# Altium schematic sheet PWR.SchDoc
size A4; SheetNumber: 6; SheetTotal: 14
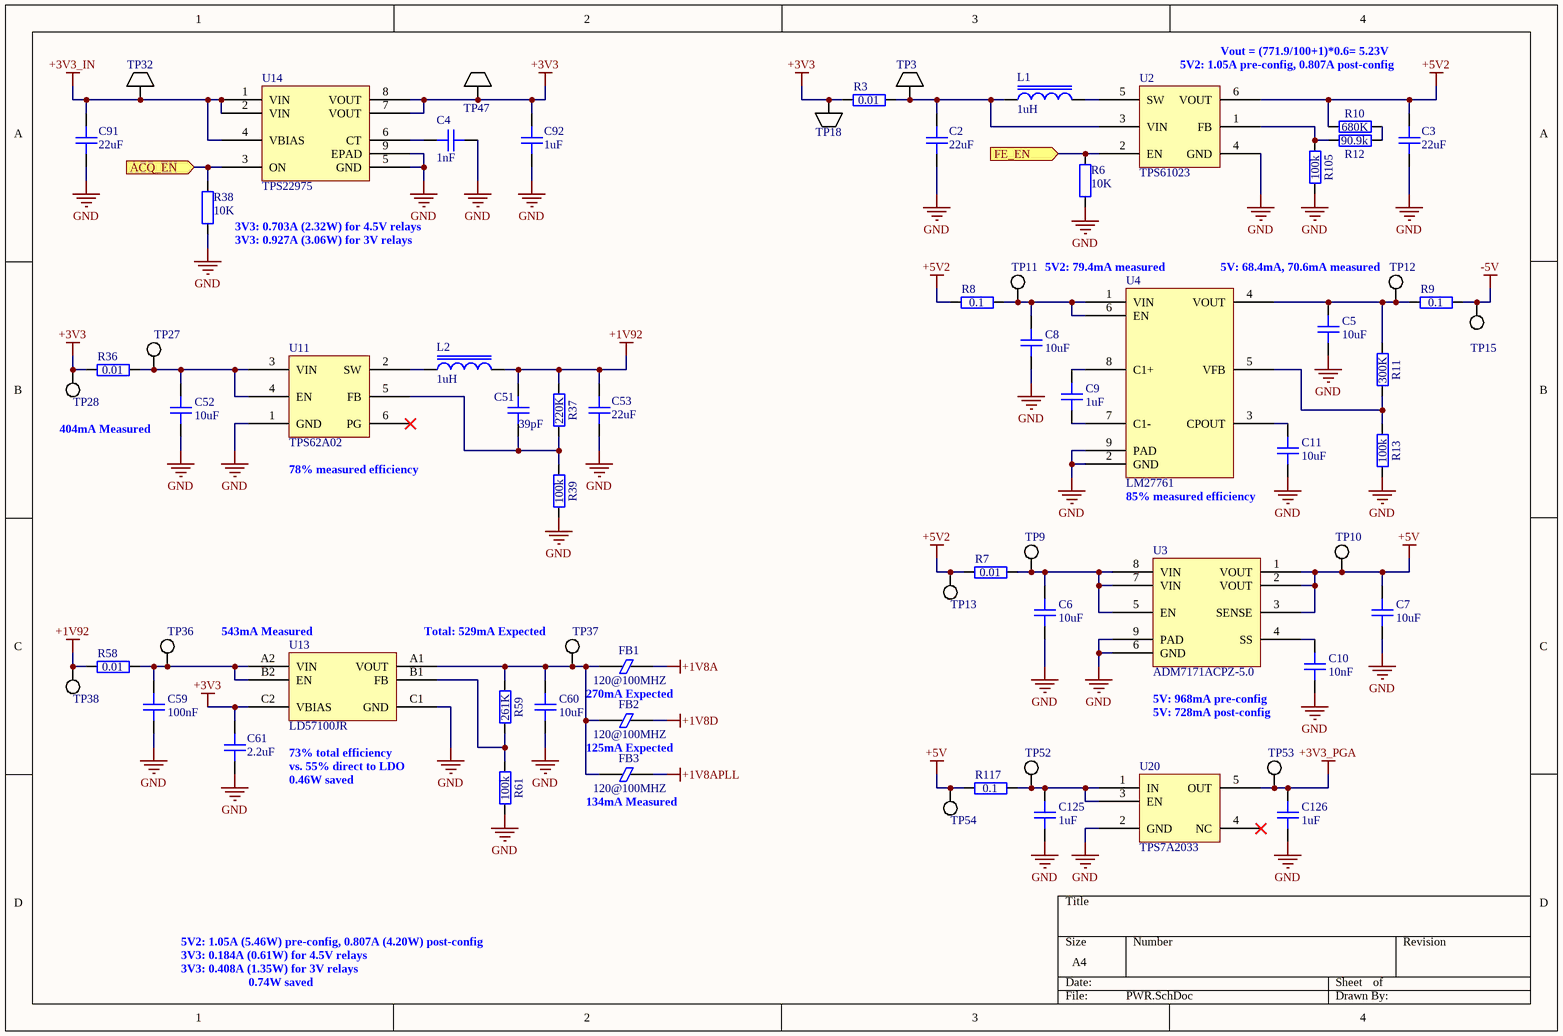
[diagram p0: PWR.SchDoc]

## Parts
C2  22uF  [GEN_C_0805]
C3  22uF  [GEN_C_0805]
C4  1nF  [GEN_C_0402]
C5  10uF  [GEN_C_0603]
C6  10uF  [GEN_C_0603]
C7  10uF  [GEN_C_0603]
C8  10uF  [GEN_C_0603]
C9  1uF  [GEN_C_0402]
C10  10nF  [GEN_C_0402]
C11  10uF  [GEN_C_0603]
C51  39pF  [GEN_C_0402]
C52  10uF  [GEN_C_0603]
C53  22uF  [GEN_C_0805]
C59  100nF  [GEN_C_0402]
C60  10uF  [GEN_C_0603]
C61  2.2uF  [GEN_C_0402]
C91  22uF  [GEN_C_0805]
C92  1uF  [GEN_C_0402]
C125  1uF  [GEN_C_0402]
C126  1uF  [GEN_C_0402]
FB1  120@100MHZ  [GEN_R_0402]
FB2  120@100MHZ  [GEN_R_0402]
FB3  120@100MHZ  [GEN_R_0402]
L1  1uH  [GEN_L_1210]
L2  1uH  [GEN_L_1210]
R3  0.01  [GEN_R_0603]
R6  10K  [GEN_R_0402]
R7  0.01  [GEN_R_0603]
R8  0.1  [GEN_R_0402]
R9  0.1  [GEN_R_0402]
R10  680K  [GEN_R_0402]
R11  300K  [GEN_R_0402]
R12  90.9k  [GEN_R_0402]
R13  100k  [GEN_R_0402]
R36  0.01  [GEN_R_0603]
R37  220K  [GEN_R_0402]
R38  10K  [GEN_R_0402]
R39  100k  [GEN_R_0402]
R58  0.01  [GEN_R_0603]
R59  261K  [GEN_R_0402]
R61  100k  [GEN_R_0402]
R105  100k  [GEN_R_0402]
R117  0.1  [GEN_R_0402]
TP3  5015  [KEY_5015]  (value not drawn)
TP9  PCB  [GEN_TP_PCB]  (value not drawn)  (no BOM)
TP10  PCB  [GEN_TP_PCB]  (value not drawn)  (no BOM)
TP11  PCB  [GEN_TP_PCB]  (value not drawn)  (no BOM)
TP12  PCB  [GEN_TP_PCB]  (value not drawn)  (no BOM)
TP13  PCB  [GEN_TP_PCB]  (value not drawn)  (no BOM)
TP15  PCB  [GEN_TP_PCB]  (value not drawn)  (no BOM)
TP18  5015  [KEY_5015]  (value not drawn)
TP27  PCB  [GEN_TP_PCB]  (value not drawn)  (no BOM)
TP28  PCB  [GEN_TP_PCB]  (value not drawn)  (no BOM)
TP32  5015  [KEY_5015]  (value not drawn)
TP36  PCB  [GEN_TP_PCB]  (value not drawn)  (no BOM)
TP37  PCB  [GEN_TP_PCB]  (value not drawn)  (no BOM)
TP38  PCB  [GEN_TP_PCB]  (value not drawn)  (no BOM)
TP47  5015  [KEY_5015]  (value not drawn)
TP52  PCB  [GEN_TP_PCB]  (value not drawn)  (no BOM)
TP53  PCB  [GEN_TP_PCB]  (value not drawn)  (no BOM)
TP54  PCB  [GEN_TP_PCB]  (value not drawn)  (no BOM)
U2  TPS61023  [TI_SOT563_DRL0006A]
U3  ADM7171ACPZ-5.0  [AD_DFN8_CP-8-21]
U4  LM27761  [TI_WSON8_DSG0008A]
U11  TPS62A02  [TI_SOT563_DRL0006A]
U13  LD57100JR  [ST_FlipChip6]
U14  TPS22975  [TI_WSON8_DSG0008A]
U20  TPS7A2033  [GEN_SOT23_5_950_2900X1600X1450]

## Ports
ACQ_EN (in), FE_EN (in)

## Nets
+1V8A: FB1.2
+1V8APLL: FB3.2
+1V8D: FB2.2
+1V92: C51.2 C53.2 L2.2 R37.2 R58.1 TP38.1
+3V3: C61.2 C92.2 R3.2 R36.1 TP18.1 TP28.1 TP47.1 U13.C2(VBIAS) U14.7(VOUT) U14.8(VOUT)
+3V3_IN: C91.2 TP32.1 U14.1(VIN) U14.2(VIN) U14.4(VBIAS)
+3V3_PGA: C126.2 TP53.1 U20.5(OUT)
+5V: C7.2 R117.1 TP10.1 TP54.1 U3.1(VOUT) U3.2(VOUT) U3.3(SENSE)
+5V2: C3.2 R7.1 R8.1 R10.2 TP13.1 U2.6(VOUT)
-5V: R9.2 TP15.1
GND: C2.1 C3.1 C4.1 C5.1 C6.1 C7.1 C8.1 C10.1 C11.1 C52.1 C53.1 C59.1 C60.1 C61.1 C91.1 C92.1 C125.1 C126.1 R6.2 R13.1 R38.1 R39.1 R61.1 R105.1 U2.4(GND) U3.6(GND) U3.9(PAD) U4.2(GND) U4.9(PAD) U11.1(GND) U13.C1(GND) U14.5(GND) U14.9(EPAD) U20.2(GND)
ACQ_EN: R38.2 U14.3(ON) ; port ACQ_EN
FE_EN: R6.1 U2.2(EN) ; port FE_EN
NetC2_2: C2.2 L1.1 R3.1 TP3.1 U2.3(VIN)
NetC4_2: C4.2 U14.6(CT)
NetC5_2: C5.2 R9.1 R11.2 TP12.1 U4.4(VOUT)
NetC6_2: C6.2 R7.2 TP9.1 U3.5(EN) U3.7(VIN) U3.8(VIN)
NetC8_2: C8.2 R8.2 TP11.1 U4.1(VIN) U4.6(EN)
NetC9_1: C9.1 U4.7(C1-)
NetC9_2: C9.2 U4.8(C1+)
NetC10_2: C10.2 U3.4(SS)
NetC11_2: C11.2 U4.3(CPOUT)
NetC51_1: C51.1 R37.1 R39.2 U11.5(FB)
NetC52_2: C52.2 R36.2 TP27.1 U11.3(VIN) U11.4(EN)
NetC59_2: C59.2 R58.2 TP36.1 U13.A2(VIN) U13.B2(EN)
NetC60_2: C60.2 FB1.1 FB2.1 FB3.1 R59.2 TP37.1 U13.A1(VOUT)
NetC125_2: C125.2 R117.2 TP52.1 U20.1(IN) U20.3(EN)
NetL1_2: L1.2 U2.5(SW)
NetL2_1: L2.1 U11.2(SW)
NetR10_1: R10.1 R12.2
NetR11_1: R11.1 R13.2 U4.5(VFB)
NetR12_1: R12.1 R105.2 U2.1(FB)
NetR59_1: R59.1 R61.2 U13.B1(FB)

Not connected (* = marked no-connect by the designer): U11 6(PG)*; U20 4(NC)*

## Notes on the sheet
- (near U2) 5V2: 1.05A pre-config, 0.807A post-config
- (near U2) Vout = (771.9/100+1)*0.6= 5.23V
- (near R38) 3V3: 0.703A (2.32W) for 4.5V relays
- (near R38) 3V3: 0.927A (3.06W) for 3V relays
- 5V2: 79.4mA measured
- 5V: 68.4mA, 70.6mA measured
- 404mA Measured
- (near U11) 78% measured efficiency
- 85% measured efficiency
- (near U13) 543mA Measured
- Total: 529mA Expected
- 270mA Expected
- 5V: 968mA pre-config
- 5V: 728mA post-config
- 73% total efficiency
- vs. 55% direct to LDO
- 0.46W saved
- 125mA Expected
- (near FB3) 134mA Measured
- 5V2: 1.05A (5.46W) pre-config, 0.807A (4.20W) post-config
- 3V3: 0.184A (0.61W) for 4.5V relays
- 3V3: 0.408A (1.35W) for 3V relays
- 0.74W saved

## Library data of the parts
C2 C3 C53 C91 = CAP 22uF 25V X5R 0805: House Part Number: C-22uF-0805-002; Manufacturer: Murata; Manufacturer Part Number: GRM21BR61E226ME44L; Voltage Rating: 25V; Package: 0805; Value: 22uF; Supplier 1: Mouser; Supplier Part Number 1: 81-GRM21BR61E226ME4L
C4 = CAP 1nF 50V C0G 0402: Manufacturer: Murata; Manufacturer Part Number: GRM1555C1H102FA01D; Voltage Rating: 50V; Package: 0402; Supplier 1: Mouser; Supplier Part Number 1: 81-GRM1555C1H102FA1D; Value: 1nF
C5-C8 C11 C52 C60 = CAP 10uF 10V X5R 0603: House Part Number: C-10uF-0603-002; Manufacturer: Murata; Manufacturer Part Number: GRM188R61A106ME69D; Voltage Rating: 10V; Package: 0402; Supplier 1: Mouser; Supplier Part Number 1: 81-GRM188R61A106ME9D; Value: 10uF
C9 C92 C125 C126 = CAP 1uF 25V X5R 0402: Manufacturer: Murata; Manufacturer Part Number: GRM155R61E105KA12D; Voltage Rating: 25V; Package: 0402; Supplier 1: Mouser; Supplier Part Number 1: 81-GRM155R61E105KA2D; Value: 1uF
C10 = CAP 10nF 50V X7R 0402: Manufacturer: Murata; House Part Number: C-10nF-0402-002; Manufacturer Part Number: GRM155R71H103KA88J; Voltage Rating: 50V; Package: 0402; Supplier 1: Mouser; Supplier Part Number 1: 81-GRM155R71H103KA8J; Value: 10nF
C51 = CAP 39pF 50V C0G 0402: House Part Number: C-39pF-0402-002; Manufacturer: KEMET; Manufacturer Part Number: C0402C390J5GACTU; Temperature Coefficient: C0G; Voltage Rating: 50V; Package: 0402; Value: 39pF; Supplier 1: Mouser; Supplier Part Number 1: 80-C0402C390J5G
C59 = CAP 100nF 16V X7R 0402: House Part Number: C-100nF-0402-002; Manufacturer: Murata; Manufacturer Part Number: GCM155R71C104KA55D; Voltage Rating: 16V; Package: 0402; Supplier 1: Mouser; Supplier Part Number 1: 81-GCM155R71C104KA5D; Value: 100nF
C61 = CAP 2.2uF 10V X5R 0402: Manufacturer: Taiyo Yuden; Manufacturer Part Number: LMK105BJ225MV-F; Voltage Rating: 10V; Package: 0402; Value: 2.2uF; Supplier 1: Mouser; Supplier Part Number 1: 963-LMK105BJ225MV-F
FB1-FB3 = FERRITE BEAD 120 OHM 0402: House Part Number: BLM15PX121SN1D; Manufacturer: Murata; Supplier 1: Mouser; Supplier Part Number 1: 81-BLM15PX121SN1D; Manufacturer Part Number: BLM15PX121SN1D
L1 L2 = IND 1uH 3.1A 45 MOHM 1210: Manufacturer: Murata; Manufacturer Part Number: 1277AS-H-1R0M=P2; Value: 1uH; Supplier 1: Mouser; Supplier Part Number 1: 81-1277AS-H-1R0MP2
R3 R7 R36 R58 = RES 0.01 OHM 1% 1/4W 0603: House Part Number: R-0.01-0603-1%-001; Manufacturer: Susumu; Manufacturer Part Number: RL0816T-R010-F; Tolerance: 1%; Supplier 1: Mouser; Supplier Part Number 1: 754-RL0816T-R010-F; Value: 0.01; Package: 0603
R6 R38 = RES 10K OHM 1% 1/10W 0402: Manufacturer: Panasonic; Manufacturer Part Number: ERJ-2RKF1002X; Tolerance: 1%; Package: 0402; Supplier 1: Mouser; Supplier Part Number 1: 667-ERJ-2RKF1002X; Value: 10K
R8 R9 R117 = RES 0.1 OHM 1% 1/6W 0402: Manufacturer: Panasonic; Manufacturer Part Number: ERJ-2BSFR10X; Tolerance: 1%; Package: 0402; Supplier 1: Mouser; Supplier Part Number 1: 667-ERJ-2BSFR10X; Value: 0.1
R10 = RES 680K OHM 1% 1/16W 0402: Manufacturer: Yageo; Manufacturer Part Number: RC0402FR-07681KL; Tolerance: 1%; Package: 0402; Supplier 1: Mouser; Supplier Part Number 1: 603-RC0402FR-07680KL; Value: 680K
R11 = RES 300K OHM 1% 1/10W 0402: Manufacturer: Panasonic; Manufacturer Part Number: ERJ-2RKF3003X; Tolerance: 1%; Package: 0402; Supplier 1: Mouser; Supplier Part Number 1: 667-ERJ-2RKF3003X; Value: 300K
R12 = RES 90.9K OHM 1% 1/16W 0402: Manufacturer: Yageo; Manufacturer Part Number: RC0402FR-0790K9L; Tolerance: 1%; Package: 0402; Supplier 1: Mouser; Supplier Part Number 1: 603-RC0402FR-0790K9L; Value: 90.9k
R13 R39 R61 R105 = RES 100K OHM 1% 1/10W 0402: House Part Number: R-100K-0402-1%-001; Manufacturer: Yageo; Manufacturer Part Number: RC0402FR-07100KL; Tolerance: 1%; Package: 0402; Supplier 1: Mouser; Supplier Part Number 1: 603-RC0402FR-07100KL; Value: 100k
R37 = RES 220K OHM 1% 1/16W 0402: Manufacturer: Yageo; Manufacturer Part Number: RC0402FR-07220KL; Tolerance: 1%; Package: 0402; Value: 220K; Supplier 1: Mouser; Supplier Part Number 1: 603-RC0402FR-07220KL
R59 = RES 261K OHM 1% 1/16W 0402: Manufacturer: Yageo; Manufacturer Part Number: RC0402FR-07261KL; Tolerance: 1%; Package: 0402; Value: 261K; Supplier 1: Mouser; Supplier Part Number 1: 603-RC0402FR-07261KL
TP3 TP18 TP32 TP47 = TP KEYSTONE 5015: Manufacturer: Keystone Electronics; Supplier 1: Mouser; Supplier Part Number 1: 534-5015; Manufacturer Part Number: 5015
TP9-TP13 TP15 TP27 TP28 TP36-TP38 TP52-TP54 = TP PCB 1mm
U2 = IC BOOST TPS61023: Manufacturer: Texas Instruments; Manufacturer Part Number: TPS61023DRLT; Supplier 1: Texas Instruments; Supplier Part Number 1: TPS61023DRLT
U3 = IC LDO ADM7171ACPZ-5.0: Manufacturer: Analog Devices; Manufacturer Part Number: ADM7171ACPZ-5.0-R7; Supplier 1: Mouser; Supplier Part Number 1: 584-ADM7171ACPZ5.0R7
U4 = IC CPUMP LM27761: Manufacturer: Texas Instruments; Manufacturer Part Number: LM27761DSGR; Supplier 1: Texas Instruments; Supplier Part Number 1: LM27761DSGR
U11 = IC BUCK TPS62A02: House Part Number: TPS62A02DRLR; Manufacturer: Texas Instruments; Supplier 1: Texas Instruments; Supplier Part Number 1: TPS62A02DRLR; Manufacturer Part Number: TPS62A02DRLR
U13 = IC LDO LD57100JR: Manufacturer: STMicroelectronics; Supplier 1: Mouser; Supplier Part Number 1: 511-LD57100JR; House Part Number: LD57100JR; Manufacturer Part Number: LD57100JR
U14 = IC SWITCH LOAD TPS22975: Manufacturer: Texas Instruments; Manufacturer Part Number: TPS22975DSGR; Supplier 1: Texas Instruments; Supplier Part Number 1: TPS22975DSGR
U20 = IC LDO TPS7A2033: Manufacturer: Texas Instruments; Manufacturer Part Number: TPS7A2033PDBVR; Supplier 1: Texas Instruments; Supplier Part Number 1: TPS7A2033PDBVR